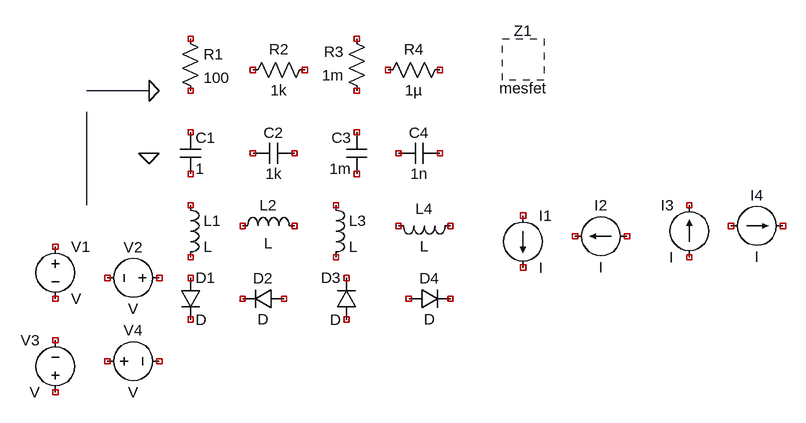
[diagram p0: schematic comps.asc]
comps.asc, the LTspice schematic file:
Version 4
SHEET 1 1032 680
WIRE 48 144 -48 144
WIRE -48 320 -48 176
FLAG 48 240 0
FLAG 48 144 0
SYMBOL res 96 48 R0
SYMATTR InstName R1
SYMATTR Value 100
SYMBOL res 304 96 R90
WINDOW 0 0 56 VBottom 2
WINDOW 3 32 56 VTop 2
SYMATTR InstName R2
SYMATTR Value 1k
SYMBOL res 384 160 R180
WINDOW 0 36 76 Left 2
WINDOW 3 36 40 Left 2
SYMATTR InstName R3
SYMATTR Value 1m
SYMBOL res 400 128 R270
WINDOW 0 32 56 VTop 2
WINDOW 3 0 56 VBottom 2
SYMATTR InstName R4
SYMATTR Value 1µ
SYMBOL cap 96 208 R0
SYMATTR InstName C1
SYMATTR Value 1
SYMBOL cap 272 224 R90
WINDOW 0 0 32 VBottom 2
WINDOW 3 32 32 VTop 2
SYMATTR InstName C2
SYMATTR Value 1k
SYMBOL cap 384 272 R180
WINDOW 0 24 56 Left 2
WINDOW 3 24 8 Left 2
SYMATTR InstName C3
SYMATTR Value 1m
SYMBOL cap 432 256 R270
WINDOW 0 32 32 VTop 2
WINDOW 3 0 32 VBottom 2
SYMATTR InstName C4
SYMATTR Value 1n
SYMBOL ind 96 304 R0
SYMATTR InstName L1
SYMBOL ind 176 368 R270
WINDOW 0 32 56 VTop 2
WINDOW 3 5 56 VBottom 2
SYMATTR InstName L2
SYMBOL ind 320 304 R0
SYMATTR InstName L3
SYMBOL ind 528 336 R90
WINDOW 0 5 56 VBottom 2
WINDOW 3 32 56 VTop 2
SYMATTR InstName L4
SYMBOL diode 96 432 R0
SYMATTR InstName D1
SYMBOL diode 256 448 R90
WINDOW 0 0 32 VBottom 2
WINDOW 3 32 32 VTop 2
SYMATTR InstName D2
SYMBOL diode 368 496 R180
WINDOW 0 24 64 Left 2
WINDOW 3 24 0 Left 2
SYMATTR InstName D3
SYMBOL diode 448 480 R270
WINDOW 0 32 32 VTop 2
WINDOW 3 0 32 VBottom 2
SYMATTR InstName D4
SYMBOL voltage -96 368 R0
SYMATTR InstName V1
SYMBOL voltage 80 432 R90
WINDOW 0 -32 56 VBottom 2
WINDOW 3 32 56 VTop 2
SYMATTR InstName V2
SYMBOL voltage -96 624 R180
WINDOW 0 24 96 Left 2
WINDOW 3 24 16 Left 2
SYMATTR InstName V3
SYMBOL voltage -32 560 R270
WINDOW 0 32 56 VTop 2
WINDOW 3 -32 56 VBottom 2
SYMATTR InstName V4
SYMBOL mesfet 624 96 R0
SYMATTR InstName Z1
SYMBOL current 624 336 R0
SYMATTR InstName I1
SYMBOL current 784 368 R90
WINDOW 0 -32 40 VBottom 2
WINDOW 3 32 40 VTop 2
SYMATTR InstName I2
SYMBOL current 880 400 R180
WINDOW 0 24 80 Left 2
WINDOW 3 24 0 Left 2
SYMATTR InstName I3
SYMBOL current 944 352 R270
WINDOW 0 32 40 VTop 2
WINDOW 3 -32 40 VBottom 2
SYMATTR InstName I4

The netlist it stands for:
* comps.asc
R1 NC_01 NC_02 100
R2 NC_03 NC_04 1k
R3 NC_05 NC_06 1m
R4 NC_07 NC_08 1µ
C1 NC_09 NC_10 1
C2 NC_11 NC_12 1k
C3 NC_13 NC_14 1m
C4 NC_15 NC_16 1n
L1 NC_17 NC_18 L
L2 NC_19 NC_20 L
L3 NC_21 NC_22 L
L4 NC_23 NC_24 L
D1 NC_25 NC_26 D
D2 NC_27 NC_28 D
D3 NC_29 NC_30 D
D4 NC_31 NC_32 D
V1 NC_33 NC_34 V
V2 NC_35 NC_36 V
V3 NC_37 NC_38 V
V4 NC_39 NC_40 V
* Z1: mesfet (symbol mesfet not available, pin order unknown); nets seen at it: 
I1 NC_41 NC_42 I
I2 NC_43 NC_44 I
I3 NC_45 NC_46 I
I4 NC_47 NC_48 I
.model D D
.lib standard.dio
.backanno
.end